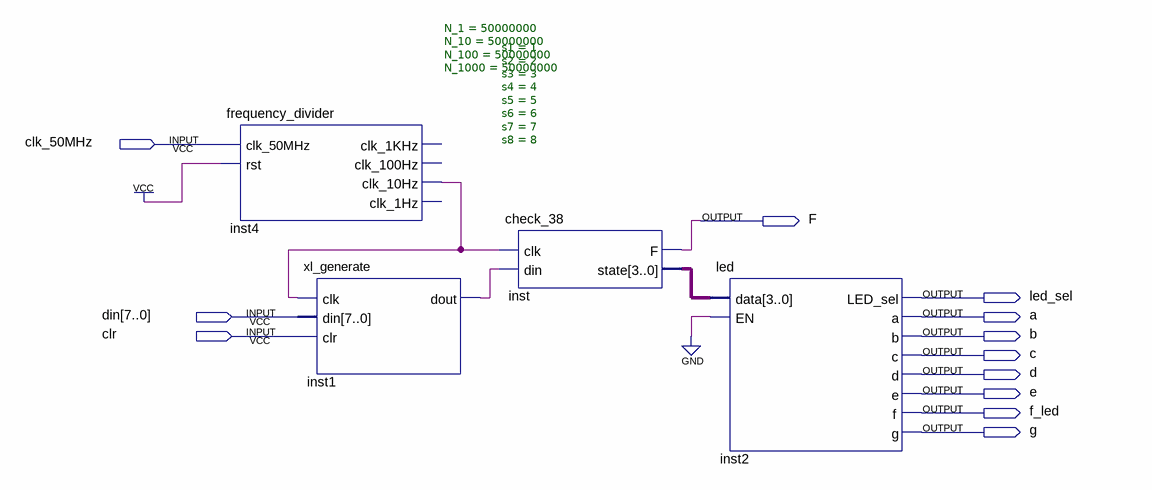
[diagram p0: schematic sheet]
// Quartus schematic project9.bdf as structural Verilog: 4 symbols, 12 pins
module project9 (
  input  clk_50MHz,
  input  [7:0] din,
  input  clr,
  output F,
  output led_sel,
  output a,
  output b,
  output c,
  output d,
  output e,
  output f_led,
  output g
);

  wire inst1_dout, inst4_clk_10hz;
  wire [3:0] inst_state;

  frequency_divider #(.N_1(50000000), .N_10(50000000), .N_100(50000000), .N_1000(50000000)) inst4 (
    .clk_50MHz(clk_50MHz), .rst(1'b1), .clk_10Hz(inst4_clk_10hz));  // open: clk_1KHz, clk_100Hz, clk_1Hz
  xl_generate inst1 (.clk(inst4_clk_10hz), .din(din), .clr(clr), .dout(inst1_dout));
  check_38 #(.s1(1), .s2(2), .s3(3), .s4(4), .s5(5), .s6(6), .s7(7), .s8(8)) inst (
    .clk(inst4_clk_10hz), .din(inst1_dout), .F(F), .state(inst_state));
  led inst2 (.data(inst_state), .EN(1'b0), .LED_sel(led_sel), .a(a), .b(b), .c(c), .d(d), .e(e), .f(f_led), .g(g));
endmodule
